# EAGLE design lednode (EAGLE 6.5.0)
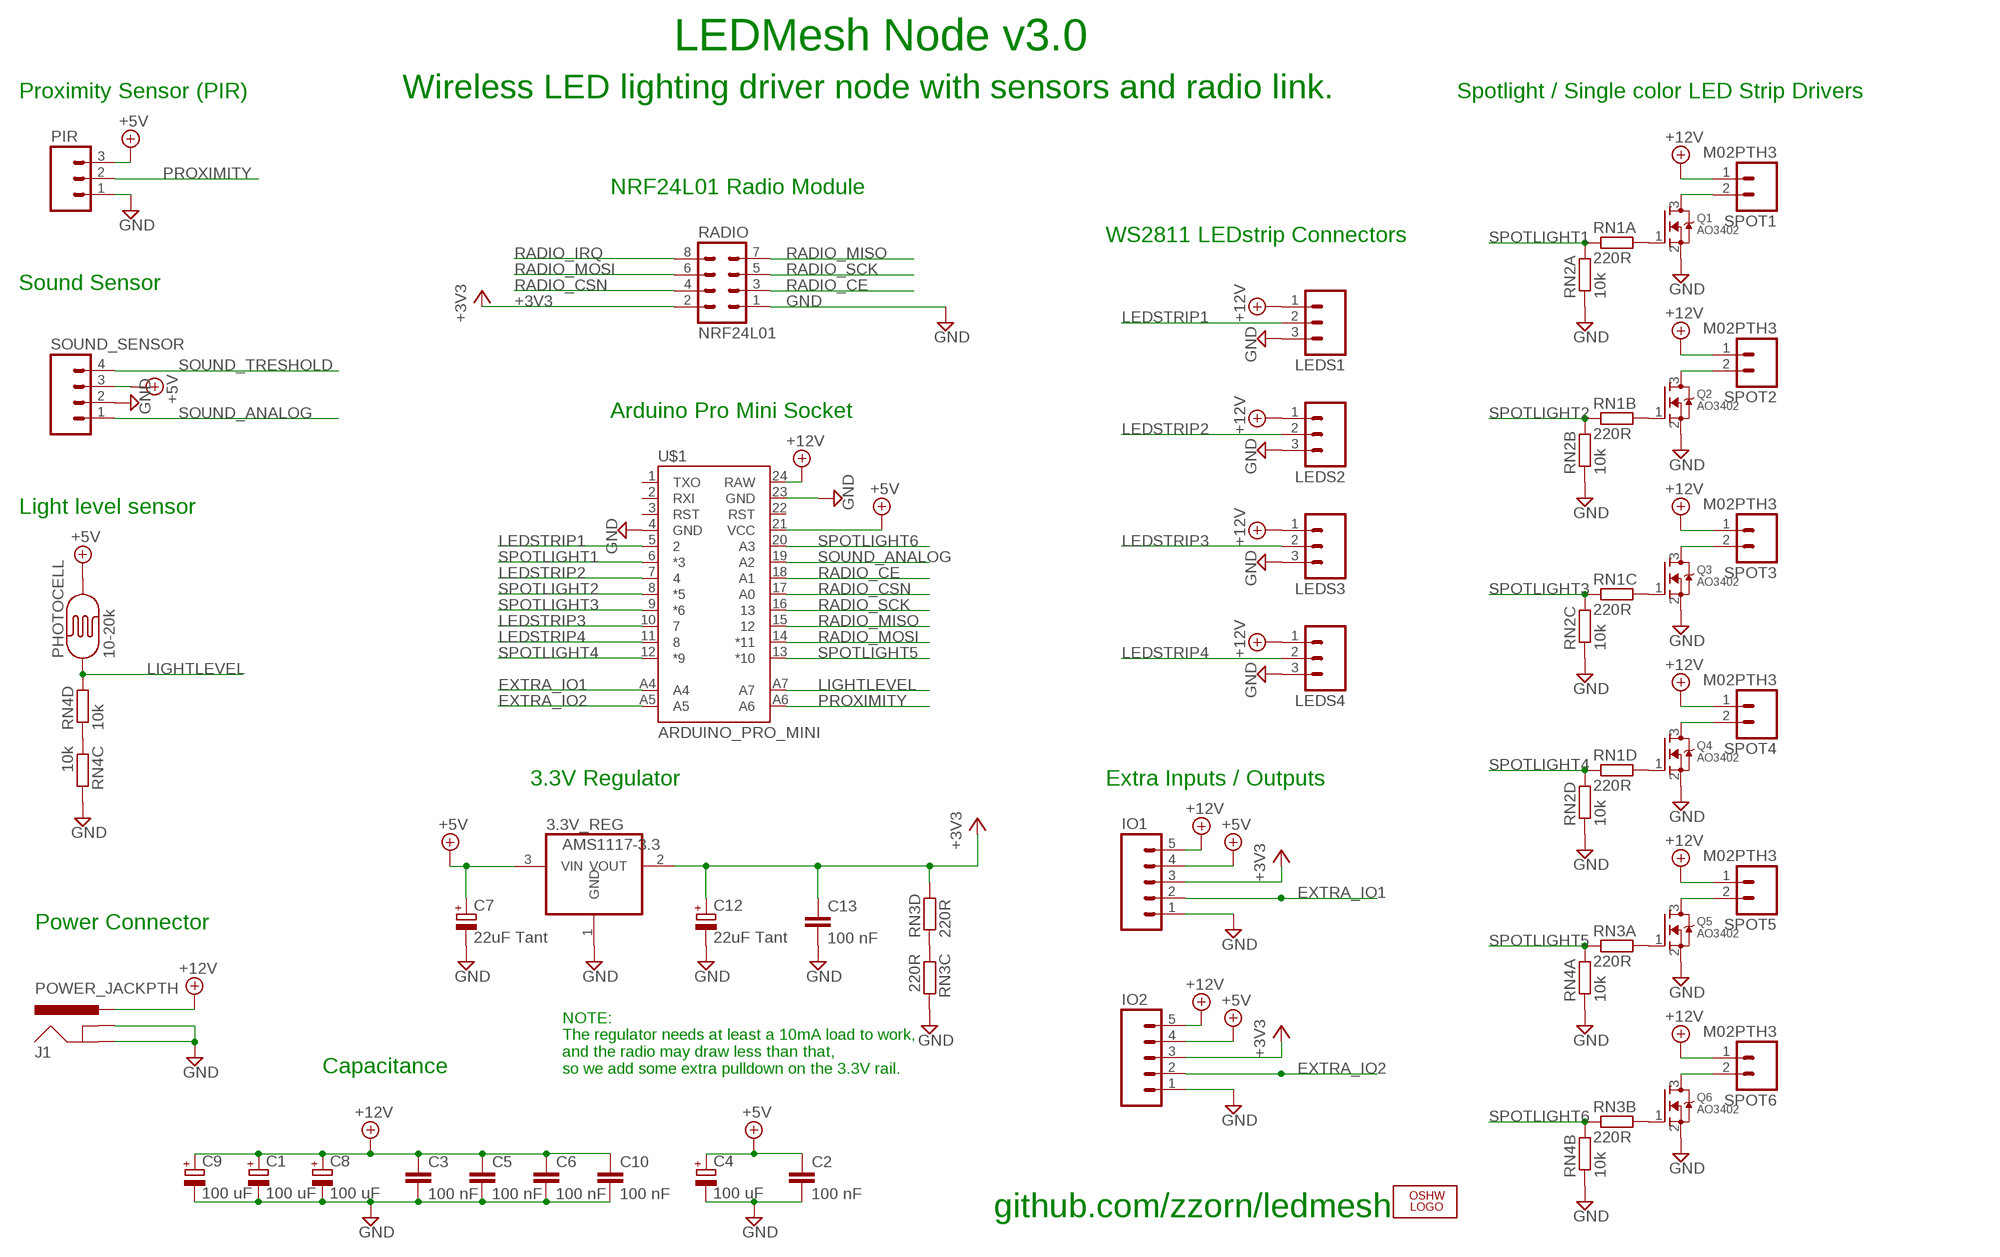
[diagram p0: schematic, sheet 1]

## Parts
3.3V_REG  AMS1117-3.3  REG1117  [SOT223]
C1  100 uF  CPOL-EUE2.5-6  [E2,5-6]
C2  100 nF  C-EUC0805  [C0805]
C3  100 nF  C-EUC0805  [C0805]
C4  100 uF  CPOL-EUE2.5-6  [E2,5-6]
C5  100 nF  C-EUC0805  [C0805]
C6  100 nF  C-EUC0805  [C0805]
C7  22uF Tant  CPOL-EUSMCA  [SMC_A]
C8  100 uF  CPOL-EUE2.5-6  [E2,5-6]
C9  100 uF  CPOL-EUE2.5-6  [E2,5-6]
C10  100 nF  C-EUC0805  [C0805]
C12  22uF Tant  CPOL-EUSMCA  [SMC_A]
C13  100 nF  C-EUC0805  [C0805]
IO1  M05PTH  [1X05]
IO2  M05PTH  [1X05]
J1  POWER_JACKPTH  [POWER_JACK_PTH]
LEDS1  M03LONGPADS  [1X03_LONGPADS]
LEDS2  M03LONGPADS  [1X03_LONGPADS]
LEDS3  M03LONGPADS  [1X03_LONGPADS]
LEDS4  M03LONGPADS  [1X03_LONGPADS]
LOGO3  LOGO-OSHW-8MILX0100-NT  [OSHW_8X100_NOTEXT]
PHOTOCELL  10-20k  PHOTOCELLPTH  [PHOTOCELL]
PIR  M03PTH  [1X03]
Q1  AO3402  MOSFET-NWAVE  [SOT23-W]
Q2  AO3402  MOSFET-NWAVE  [SOT23-W]
Q3  AO3402  MOSFET-NWAVE  [SOT23-W]
Q4  AO3402  MOSFET-NWAVE  [SOT23-W]
Q5  AO3402  MOSFET-NWAVE  [SOT23-W]
Q6  AO3402  MOSFET-NWAVE  [SOT23-W]
RADIO  NRF24L01  MA04-2  [MA04-2]
RN1  220R  RESISTOR_ARRAY_4  [RN8P-4R-CRA06S]
RN2  10k  RESISTOR_ARRAY_4  [RN8P-4R-CRA06S]
RN3  220R  RESISTOR_ARRAY_4  [RN8P-4R-CRA06S]
RN4  10k  RESISTOR_ARRAY_4  [RN8P-4R-CRA06S]
SOUND_SENSOR  M041X04_NO_SILK  [1X04_NO_SILK]
SPOT1  M02PTH3  [1X02_LONGPADS]
SPOT2  M02PTH3  [1X02_LONGPADS]
SPOT3  M02PTH3  [1X02_LONGPADS]
SPOT4  M02PTH3  [1X02_LONGPADS]
SPOT5  M02PTH3  [1X02_LONGPADS]
SPOT6  M02PTH3  [1X02_LONGPADS]
U$1  ARDUINO_PRO_MINI  [ARDUINO_PRO_MINI]

## Nets
+3V3: 3.3V_REG.2(VOUT) C12.+ C13.1 IO1.3 IO2.3 RADIO.2 RN3.5
+5V: 3.3V_REG.3(VIN) C2.1 C4.+ C7.+ IO1.4 IO2.4 PHOTOCELL.2 PIR.3 SOUND_SENSOR.3 U$1.21(VCC)
+12V: C1.+ C3.1 C5.1 C6.1 C8.+ C9.+ C10.1 IO1.5 IO2.5 J1.PWR LEDS1.1 LEDS2.1 LEDS3.1 LEDS4.1 SPOT1.1 SPOT2.1 SPOT3.1 SPOT4.1 SPOT5.1 SPOT6.1 U$1.24(RAW)
EXTRA_IO1: IO1.2 U$1.A4
EXTRA_IO2: IO2.2 U$1.A5
GND: 3.3V_REG.1(GND) C1.- C2.2 C3.2 C4.- C5.2 C6.2 C7.- C8.- C9.- C10.2 C12.- C13.2 IO1.1 IO2.1 J1.GND J1.GNDBREAK LEDS1.3 LEDS2.3 LEDS3.3 LEDS4.3 PIR.1 Q1.2(S) Q2.2(S) Q3.2(S) Q4.2(S) Q5.2(S) Q6.2(S) RADIO.1 RN2.1 RN2.2 RN2.3 RN2.4 RN3.6 RN4.1 RN4.2 RN4.6 SOUND_SENSOR.2 U$1.4(GND) U$1.23(GND)
LEDSTRIP1: LEDS1.2 U$1.5
LEDSTRIP2: LEDS2.2 U$1.7
LEDSTRIP3: LEDS3.2 U$1.10
LEDSTRIP4: LEDS4.2 U$1.11
LIGHTLEVEL: PHOTOCELL.1 RN4.5 U$1.A7
N$1: Q5.3(D) SPOT5.2
N$2: Q1.3(D) SPOT1.2
N$3: Q2.3(D) SPOT2.2
N$4: Q4.3(D) SPOT4.2
N$5: Q3.3(D) SPOT3.2
N$6: Q1.1(G) RN1.8
N$7: Q2.1(G) RN1.7
N$8: Q4.1(G) RN1.5
N$9: Q3.1(G) RN1.6
N$10: Q5.1(G) RN3.8
N$11: Q6.3(D) SPOT6.2
N$12: RN4.3 RN4.4
N$13: Q6.1(G) RN3.7
N$14: RN3.3 RN3.4
PROXIMITY: PIR.2 U$1.A6
RADIO_CE: RADIO.3 U$1.18(A1)
RADIO_CSN: RADIO.4 U$1.17(A0)
RADIO_IRQ: RADIO.8
RADIO_MISO: RADIO.7 U$1.15
RADIO_MOSI: RADIO.6 U$1.14(*11)
RADIO_SCK: RADIO.5 U$1.16
SOUND_ANALOG: SOUND_SENSOR.1 U$1.19(A2)
SOUND_TRESHOLD: SOUND_SENSOR.4
SPOTLIGHT1: RN1.1 RN2.8 U$1.6(*3)
SPOTLIGHT2: RN1.2 RN2.7 U$1.8(*5)
SPOTLIGHT3: RN1.3 RN2.6 U$1.9(*6)
SPOTLIGHT4: RN1.4 RN2.5 U$1.12(*9)
SPOTLIGHT5: RN3.1 RN4.8 U$1.13(*10)
SPOTLIGHT6: RN3.2 RN4.7 U$1.20(A3)
Unconnected: U$1.1(TXO) U$1.2(RXI) U$1.3(RST) U$1.22(RST)

## Notes on the sheet
- LEDMesh Node v3.0
- Proximity Sensor (PIR) | Wireless LED lighting driver node with sensors and radio link. | Spotlight / Single color LED Strip Drivers
- NRF24L01 Radio Module
- WS2811 LEDstrip Connectors
- Sound Sensor
- Arduino Pro Mini Socket
- Light level sensor
- 3.3V Regulator | Extra Inputs / Outputs
- Power Connector
- Capacitance
- NOTE:
  The regulator needs at least a 10mA load to work, 
  and the radio may draw less than that, 
  so we add some extra pulldown on the 3.3V rail.
- github.com/zzorn/ledmesh

## Library data of the parts
3.3V_REG = burr-brown:REG1117: 800mA and 1A Low Dropout (LDO) Positive Regulator 1.8V, 2.5V, 2.85V, 3.3V, 5V, and Adj; MPN: REG1117; OC_FARNELL: 1097566; OC_NEWARK: 14P6981
C1 C4 C7-C9 C12 = rcl:CPOL-EU: POLARIZED CAPACITOR, European symbol
C2 C3 C5 C6 C10 C13 = rcl:C-EU: CAPACITOR, European symbol
IO1 IO2 = SparkFun-Connectors:M05: Header 5 Standard 5-pin 0.1" header. Use with straight break away headers (SKU : PRT-00116), right angle break away headers (PRT-00553), swiss pins (PRT-00743), machine pins (PRT-00117), and female headers (PRT-00115). Molex polarized connector foot print use with SKU : PRT-08230 with associated crimp pins and housings.
J1 = SparkFun-Connectors:POWER_JACK: Power Jack This is the standard 5.5mm barrel jack for power. The PTH is the most common, proven, reliable, footprint. The Slot footprint only works if the mill layer is transmitted to the PCB fab house so be warned. Mating wall wart : TOL-00298 (and others); PROD_ID: PRT-00119
LEDS1-LEDS4 PIR = SparkFun-Connectors:M03: Header 3 Standard 3-pin 0.1" header. Use with straight break away headers (SKU : PRT-00116), right angle break away headers (PRT-00553), swiss pins (PRT-00743), machine pins (PRT-00117), and female headers (PRT-00115). Molex polarized connector foot print use with SKU : PRT-08232 with associated crimp pins and housings.
LOGO3 = Logo:LOGO-OSHW-8MIL
PHOTOCELL = SparkFun-Sensors:PHOTOCELL: CdS photoresistor. This is a low cost way to detect light levels. Resistance decreases with more incoming light. SparkFun SKU: SEN-09088
Q1-Q6 = adafruit:MOSFET-N: N-Channel Mosfet 2N7002E - 60V 260mA SOT23 [Digikey: 2N7002ET1GOSTR-ND] - REEL BSH103 - 30V 850mA SOT23 [Digikey: 568-5013-1-ND]
RADIO = con-lstb:MA04-2: PIN HEADER; OC_FARNELL: unknown; OC_NEWARK: unknown
RN1-RN4 = dp_devices:RESISTOR_ARRAY_4: 4 Resistor Array 0603
SOUND_SENSOR = SparkFun-Connectors:M04: Header 4 Standard 4-pin 0.1" header. Use with straight break away headers (SKU : PRT-00116), right angle break away headers (PRT-00553), swiss pins (PRT-00743), machine pins (PRT-00117), and female headers (PRT-00115). Molex polarized connector foot print use with SKU : PRT-08231 with associated crimp pins and housings. 1MM SMD Version SKU: PRT-10208
SPOT1-SPOT6 = SparkFun-Connectors:M02: Standard 2-pin 0.1" header. Use with - straight break away headers ( PRT-00116) - right angle break away headers (PRT-00553) - swiss pins (PRT-00743) - machine pins (PRT-00117) - female headers (PRT-00115) Molex polarized connector foot print use with: PRT-08233 with associated crimp pins and housings. 2.54_SCREWTERM for use with PRT-10571. 3.5mm Screw Terminal footprints for PRT-08084 5mm Screw Terminal footprints for use with PRT-08433
U$1 = SparkFun-Boards-with-arduino-pro-mini-without-connection-pins:ARDUINO_PRO_MINI

## Board
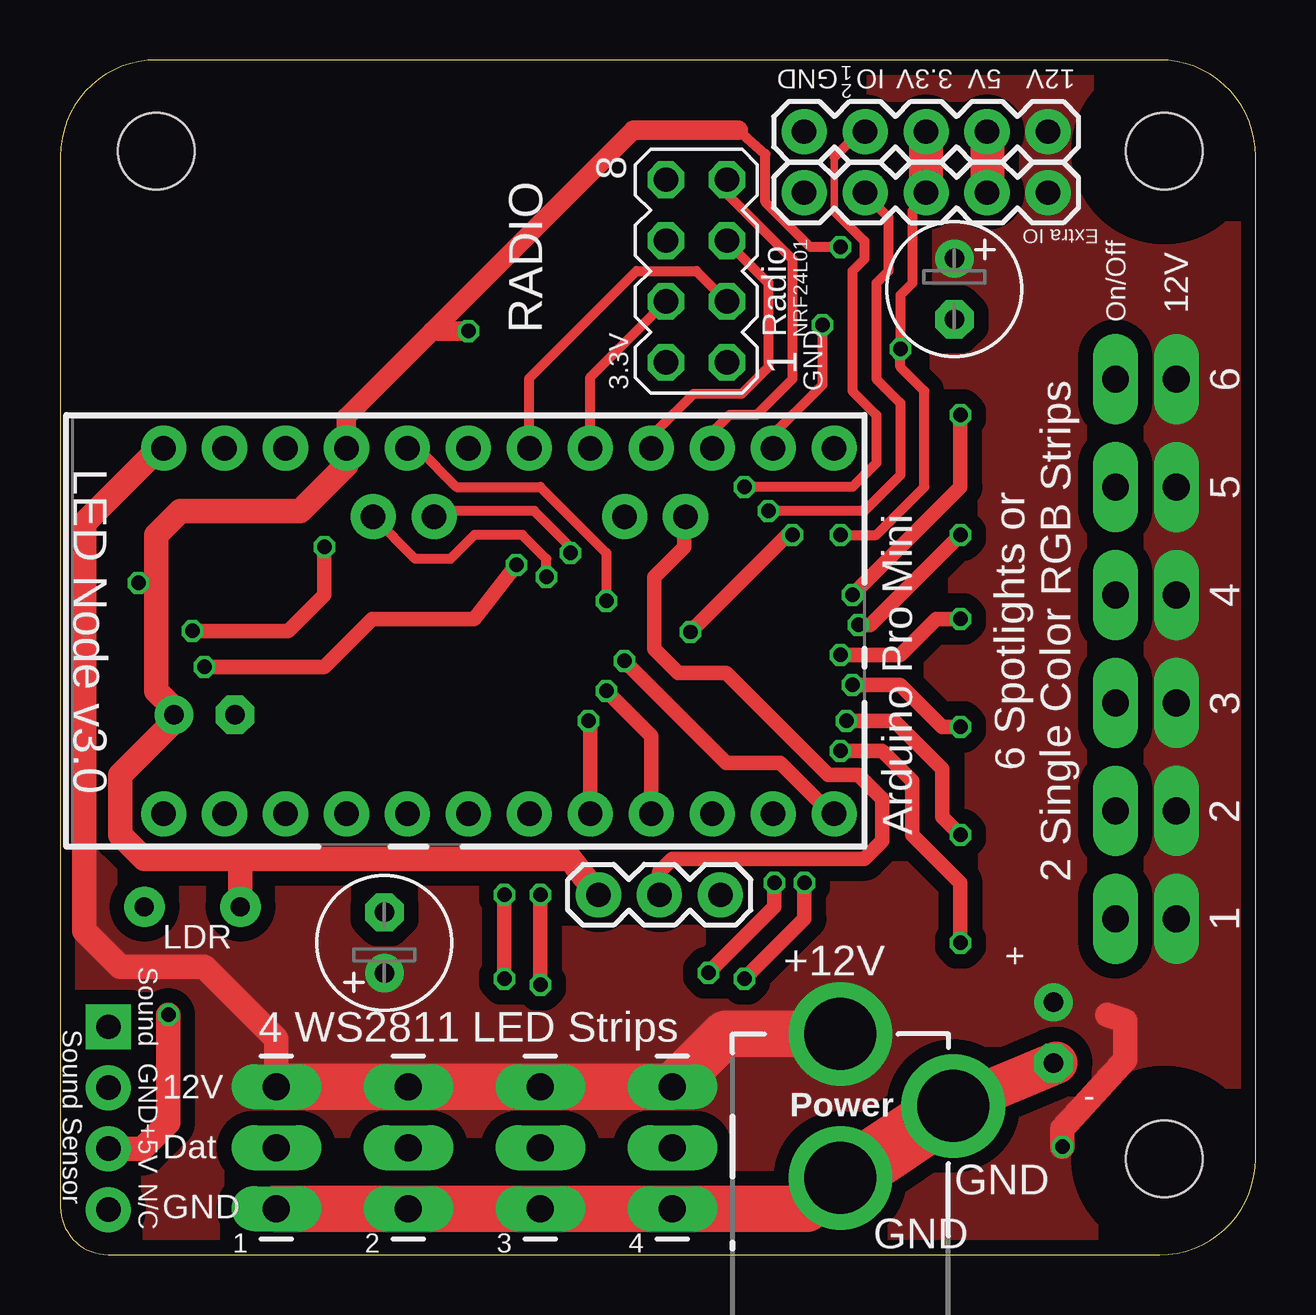
[diagram p1: board, top side]
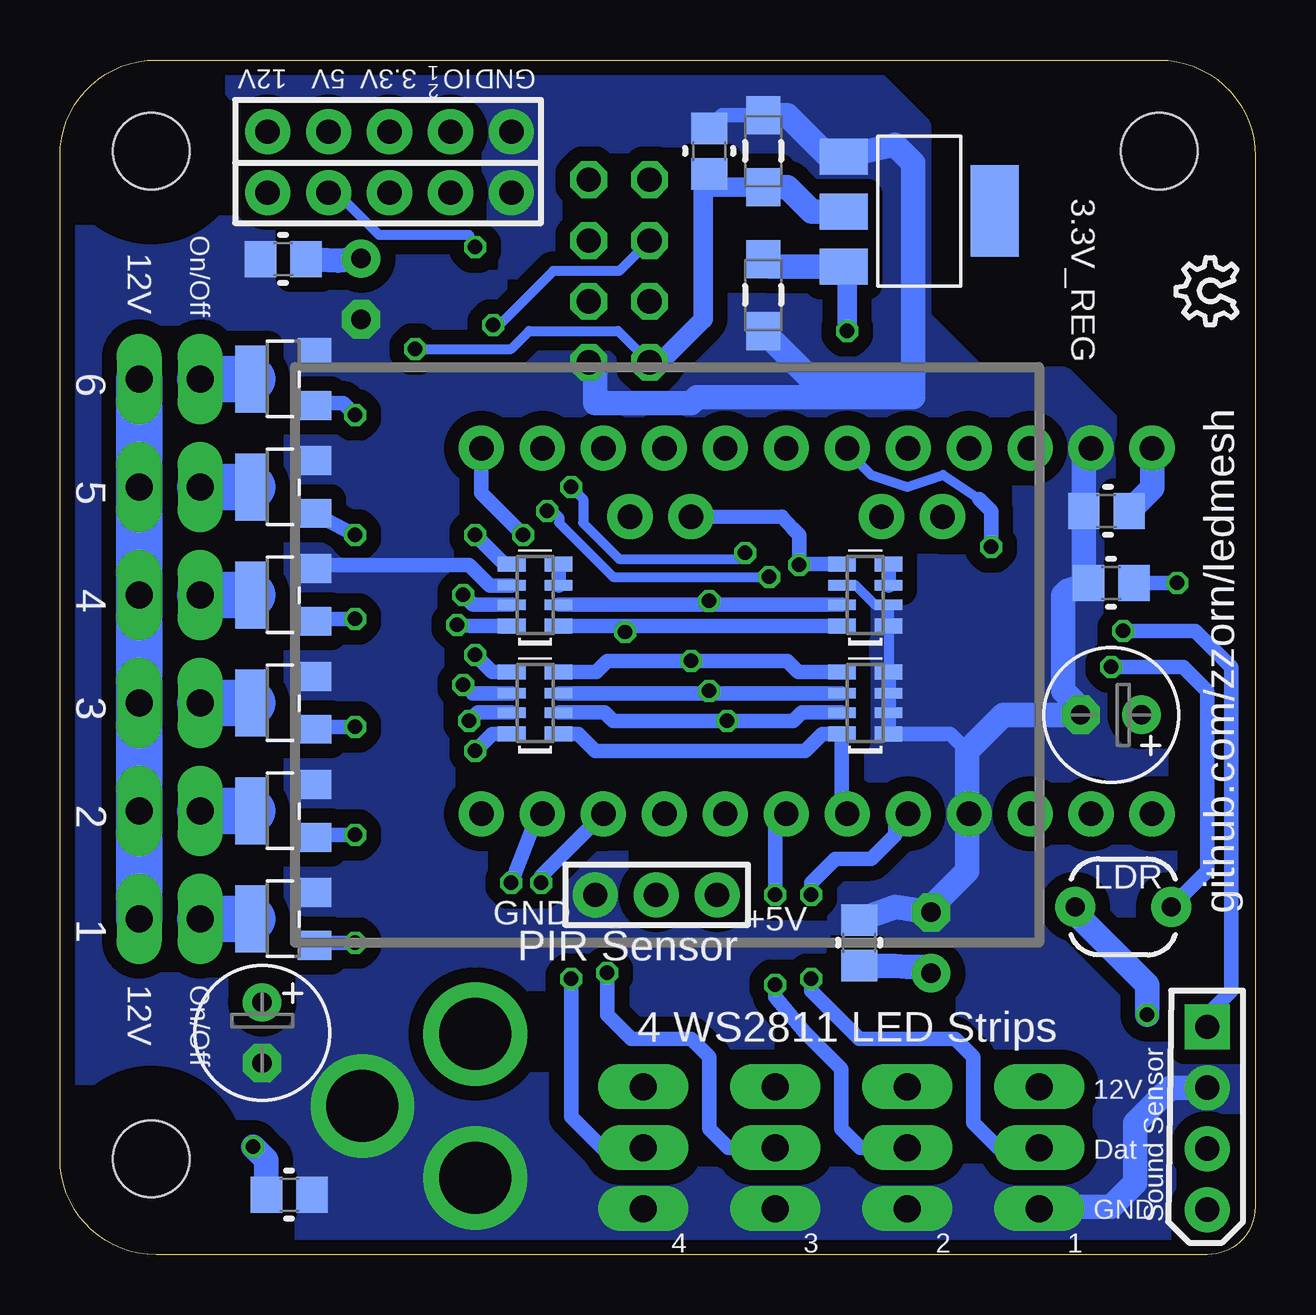
[diagram p2: board, bottom side, seen from below]

Size 49.8 x 49.8 mm. Coordinates in mm from the lower left corner, seen from the top.
Outline: 0,45.8 0,2 arc90 2,0 45.8,0 arc90 49.8,4 49.8,45.8 arc90 45.8,49.8 4,49.8 arc90 0,45.8
Copper layers (1*16): Top 0.035mm / dielectric 1.5mm / Bottom 0.035mm
Design rules "SeeedStudio_2layer_DRU_no_angle_20140221": minimum track width 6mil, minimum drill 12mil, track to track 6mil, track to pad 6mil, pad to pad 6mil, via to via 6mil, smd to smd 0mil, copper to edge 10mil, drill to drill 10mil, minimum pad ring 10mil, minimum via ring 6mil, stop-mask expansion 2mil, vias tented up to drill 100mil, thermal gap 10mil
Holes 3.2 mm at 46,46 46,4 4,46
tRestrict: area 44,2 to 48,6; area 44,44 to 48,48; area 2,44 to 6,48
bRestrict: area 44,2 to 48,6; area 44,44 to 48,48; area 2,44 to 6,48

### Footprints (pad centres in the part's own frame; a part is rotated, then mirrored left to right if it is on the bottom)
SOT223 = smd 1.499 x 2.007: 1 -2.261,-3.15; 2 0.025,-3.15; 3 2.311,-3.15 | smd 3.81 x 2.007: 4 0,3.15
E2,5-6 = drill 0.813 pad 1.6: + -1.27,0 | drill 0.813 pad 1.6 octagon: - 1.27,0
C0805 = smd 1.3 x 1.5: 1 -0.95,0; 2 0.95,0
SMC_A = smd 1.6 x 1.4: + -1.5,0; - 1.5,0
1X05 = drill 1.016 pad 1.88: 1 0,0; 2 2.54,0; 3 5.08,0; 4 7.62,0; 5 10.16,0
POWER_JACK_PTH = drill 2.997 pad 4.318: GND 0,7.7; GNDBREAK 4.7,10.7; PWR 0,13.7
1X03_LONGPADS = drill 1.118 pad 1.88 long: 1 0,0; 2 2.54,0; 3 5.08,0
PHOTOCELL = drill 0.8 pad 1.676: 1 -2,0; 2 2,0
1X03 = drill 1.016 pad 1.88: 1 0,0; 2 2.54,0; 3 5.08,0
SOT23-W = smd 1.2 x 1.4: 1 -1.1,-1.3; 2 1.1,-1.3 | smd 2.8 x 1.4: 3 0,1.3
MA04-2 = drill 1.016 octagon: 1 -3.81,-1.27; 2 -3.81,1.27; 3 -1.27,-1.27; 4 -1.27,1.27; 5 1.27,-1.27; 6 1.27,1.27; 7 3.81,-1.27; 8 3.81,1.27
RN8P-4R-CRA06S = smd 0.63 x 1.15: 1 -1.295,-0.975; 4 1.295,-0.975; 5 1.295,0.975; 8 -1.295,0.975 | smd 0.44 x 1.15: 2 -0.4,-0.975; 3 0.4,-0.975; 6 0.4,0.975; 7 -0.4,0.975
1X04_NO_SILK = drill 1.016 pad 1.88 square: 1 0,0 | drill 1.016 pad 1.88: 2 2.54,0; 3 5.08,0; 4 7.62,0
1X02_LONGPADS = drill 1.118 pad 1.88 long: 1 0,0; 2 2.54,0
ARDUINO_PRO_MINI = drill 1.016 pad 1.88: 1 -7.62,12.7; 2 -7.62,10.16; 3 -7.62,7.62; 4 -7.62,5.08; 5 -7.62,2.54; 6 -7.62,0; 7 -7.62,-2.54; 8 -7.62,-5.08; 9 -7.62,-7.62; 10 -7.62,-10.16; 11 -7.62,-12.7; 12 -7.62,-15.24; 13 7.62,-15.24; 14 7.62,-12.7; 15 7.62,-10.16; 16 7.62,-7.62; 17 7.62,-5.08; 18 7.62,-2.54; 19 7.62,0; 20 7.62,2.54; 21 7.62,5.08; 22 7.62,7.62; 23 7.62,10.16; 24 7.62,12.7; A4 4.763,1.429; A5 4.763,3.969; A6 4.763,-9.049; A7 4.763,-6.509

### Placement (x,y rotation side)
3.3V_REG  14,43.5 270 bottom
C1  13.5,13 90 top
C2  6,28 180 bottom
C3  16.5,13 90 bottom
C4  6,22.5 180 bottom
C5  6.2,31 180 bottom
C6  40.5,41.5 180 bottom
C7  20.5,40 270 bottom
C8  41.38,9.25 270 bottom
C9  37.25,40.25 270 top
C10  40.25,2.5 0 bottom
C12  20.5,46 90 bottom
C13  22.75,46 90 bottom
IO1  30.99,46.81 0 top
IO2  30.99,44.27 0 top
J1  32.5,-4.5 0 top
LEDS1  9,7 270 top
LEDS2  14.5,7 270 top
LEDS3  20,7 270 top
LEDS4  25.5,7 270 top
LOGO3  0.75,38.75 90 bottom
PHOTOCELL  5.5,14.5 180 bottom
PIR  27.5,15 180 top
Q1  40.5,14 90 bottom
Q2  40.5,18.5 90 bottom
Q3  40.5,23 90 bottom
Q4  40.5,27.5 90 bottom
Q5  40.5,32 90 bottom
Q6  40.5,36.5 90 bottom
RADIO  26.5,41 90 top
RN1  30,23 90 bottom
RN2  16.25,23 90 bottom
RN3  30,27.5 90 bottom
RN4  16.25,27.5 90 bottom
SOUND_SENSOR  2,9.5 270 top
SPOT1  46.5,14 180 top
SPOT2  46.5,18.5 180 top
SPOT3  46.5,23 180 top
SPOT4  46.5,27.5 180 top
SPOT5  46.5,32 180 top
SPOT6  46.5,36.5 180 top
U$1  17,26 90 top

### Tracks (layer width: path | path; a pad name or v marks a point on that pad's centre or on a via)
+3V3  (via drill 0.6)
  Top 0.406: IO2.3 35.82,43.82 35.5,43.5 35.5,40.5 35,40 v35,37.75 35,37 36,36 36,32 34,30 v32.5,30
  Top 1.422: IO2.3 IO1.3
  Bottom 0.406: 24.81,37.19 RADIO.2 26.54,38.5 30.25,38.5 31,37.75 v35,37.75
  Bottom 0.61: RN3.5 31.3,28.8 v32.5,30 | C13.1 22.7,44.5
  Bottom 0.813: 24.81,37.19 23,39 23,44.5 22.7,44.5 C12.+
  Bottom 1.016: 3.3V_REG.2 18.48,43.48 19.5,44.5 C12.+
+5V  (via drill 0.6)
  Top 0.406: v32.5,42 31.25,42 29.38,43.88 29.38,45.88 28.25,46.88
  Top 0.61: v3.25,28 4,28
  Top 0.813: U$1.21 11.92,34.92 15.5,38.5 | 15.5,38.5 v17,38.5 | 28.25,46.88 23.88,46.88 15.5,38.5
  Top 1.016: U$1.21 11.92,32.92 10,31 5,31 4,30 4,28 4,23.5 4.5,23 C4.+ 4.77,22.27 2.5,20 2.5,17.5 3.5,16.5 7.5,16.5 | PIR.3 21.25,16.5 7.5,16.5 | SOUND_SENSOR.3 3.42,4.42 4.5,5.5 v4.5,10 | PHOTOCELL.2 7.5,16.5
  Top 1.422: IO1.4 IO2.4
  Bottom 0.406: v32.5,42 32.75,42.5 36.5,42.5 38,44 38.34,44 IO2.4
  Bottom 0.61: C2.1 v3.25,28
  Bottom 0.813: v17,38.5 17,41.04 3.3V_REG.3
  Bottom 1.016: 3.3V_REG.3 20.19,41.19 C7.+ | v4.5,10 4.5,11.25 7.5,14.25 PHOTOCELL.2
+12V  (via drill 0.6)
  Top 1.016: U$1.24 4.12,33.62 1,30.5 1,13.5 2.5,12 6,12 9,9 LEDS1.1 | v41.75,4.5 41.75,5.25 44.38,8.12 44.38,9.75 43.62,10
  Top 1.93: LEDS1.1 LEDS2.1 LEDS3.1 LEDS4.1 27.7,9.2 J1.PWR
  Bottom 1.016: C3.1 15.05,12.05 14.5,12 13.77,12 C1.+ | U$1.24 4.3,31.95 C5.1 | C10.1 41.2,3.95 v41.75,4.5 | C6.1 38.2,41.43 C9.+
  Bottom 1.93: SPOT6.1 SPOT5.1 SPOT4.1 SPOT3.1 SPOT2.1 SPOT1.1
  pour Top (isolate 0.61, no thermals): 0,17 34,17 34,50 50,50 50,0 0,0
EXTRA_IO1  (via drill 0.6)
  Top 0.305: 32.25,45.75 32.25,43.5
  Top 0.406: IO1.2 33.28,46.78 32.25,45.75 | 32.25,43.5 33.5,42.25 33.5,41.5 33,41 33,36 34,35 34,33 33,32 v28.5,32 | v21.25,29.25 21.25,29.5 19.75,31 16.06,31 U$1.A4
  Bottom 0.406: v28.5,32 28,31.5 28,30.5 26.5,29 21.5,29 v21.25,29.25
EXTRA_IO2  (via drill 0.6)
  Top 0.406: IO2.2 33.53,44.22 34.5,43.25 34.5,41 34,40.5 34,36.5 35,35.5 35,32.5 33.5,31 v29.5,31 | v20.25,28.25 20.25,29 19.25,30 17.25,30 16.25,29 14.79,29 U$1.A5
  Bottom 0.406: v29.5,31 29.25,31 29,30.75 29,30.5 26.75,28.25 v20.25,28.25
GND
  Top 1.778: J1.GNDBREAK 41.5,8
  Top 1.93: LEDS1.3 LEDS2.3 LEDS3.3 LEDS4.3 31.09,1.92 J1.GND 32.7,3.2
  Top 2.54: 32.7,3.2 37.25,6.25
  Bottom 0.406: RN4.6 16.65,27.9 15.85,27.1 RN4.2 RN4.1 RN2.4
  Bottom 0.61: RN2.4 RN2.3 RN2.2 RN2.1 12.71,21.7 12,21 | RN3.6 31.9,27.9 32.75,28.75 39.05,28.75 Q4.2 | C13.2 22.2,47.5 C12.-
  Bottom 1.016: C12.- 19.5,47.5 17.76,45.76 3.3V_REG.1 15.01,46.26 14.25,45.5 14.25,35.75 23.25,35.75 23.5,35.5 27.5,35.5 27.5,36.75 27.75,37 | 14.25,36.75 14.5,36.5 18.5,36.5 C7.- | U$1.23 7.15,33.31 C5.2 7.15,28.2 C2.2 7.77,27.68 7.82,27.68 8,27.5 8,23.5 7.5,23 C4.- 10.5,22.5 12,21 12,18.46 U$1.4 12,18.3 12,16 13.5,14.5 C1.- 15,14.5 C3.2 | SOUND_SENSOR.2 3.54,6.96 5,5.5 5,3 6,2 8.92,2 LEDS1.3
  pour Bottom (isolate 0.61, no thermals): 5,33.5 8,36.5 11.5,36.5 14,39 14,47 17,50 50,50 50,0 0,0 0,17 4,19
LEDSTRIP1  (via drill 0.6)
  Top 0.61: v18.5,11.5 v18.5,15
  Bottom 0.61: LEDS1.2 10.71,4.46 11.75,5.5 11.75,8.25 12.5,9 16.5,9 18.5,11 v18.5,11.5 | v18.5,15 18.5,15.5 17.5,16.5 16,16.5 15,17.5 15,17.84 U$1.5
LEDSTRIP2  (via drill 0.6)
  Top 0.61: v20,11.25 v20,15
  Bottom 0.61: LEDS2.2 16.46,4.46 17.25,5.25 17.25,7.75 18.75,9.25 20,10.75 v20,11.25 | v20,15 20,18 U$1.7
LEDSTRIP3  (via drill 0.6)
  Top 0.61: v27,11.75 29.75,14.5 v29.75,15.5
  Bottom 0.61: LEDS3.2 21.96,4.46 22.75,5.25 22.75,8.25 23.5,9 26,9 27,10 v27,11.75 | v29.75,15.5 29.75,15.79 U$1.10
LEDSTRIP4  (via drill 0.6)
  Top 0.61: v28.5,11.5 31,14 v31,15.5
  Bottom 0.61: LEDS4.2 27.21,4.46 28.5,5.75 v28.5,11.5 | v31,15.5 30,18.08 U$1.11
LIGHTLEVEL  (via drill 0.6)
  Top 0.61: v6,24.5 11,24.5 13,26.5 17.25,26.5 v19,28.75
  Bottom 0.61: PHOTOCELL.1 2,16 2,23.5 3,24.5 v6,24.5 | v19,28.75 19,29 | RN4.5 18.95,28.8 19,29 | U$1.A7 19.75,30.75 19.74,30.76 19.26,30.26 19,30 19,29
N$1
  Bottom 1.93: Q5.3 SPOT5.2
N$2
  Bottom 1.93: Q1.3 SPOT1.2
N$3
  Bottom 1.93: Q2.3 SPOT2.2
N$4
  Bottom 1.93: Q4.3 SPOT4.2
N$5
  Bottom 1.93: Q3.3 SPOT3.2
N$6  (via drill 0.6)
  Top 0.61: v32.5,21 34.25,21 35.5,19.75 35.5,17.5 37.5,15.5 v37.5,13
  Bottom 0.61: RN1.8 31.8,21.7 v32.5,21 | v37.5,13 39.1,13 Q1.1
N$7  (via drill 0.6)
  Top 0.61: v32.75,22.25 34.75,22.25 36.75,20.25 36.75,18.25 v37.5,17.5
  Bottom 0.61: RN1.7 32.4,22.6 v32.75,22.25 | v37.5,17.5 39.1,17.5 Q2.1
N$8  (via drill 0.6)
  Top 0.61: v32.5,25 35,25 36.5,26.5 v37.5,26.5
  Bottom 0.61: RN1.5 31.8,24.3 v32.5,25 | v37.5,26.5 39.1,26.5 Q4.1
N$9  (via drill 0.6)
  Top 0.61: v33,23.75 35,23.75 36.75,22 v37.5,22
  Bottom 0.61: RN1.6 32.6,23.4 v33,23.75 | v37.5,22 39.1,22 Q3.1
N$10  (via drill 0.6)
  Top 0.61: v33.25,26.25 33.75,26.25 v37.5,30
  Bottom 0.61: RN3.8 32.7,26.2 v33.25,26.25 | v37.5,30 Q5.1
N$11
  Bottom 1.93: Q6.3 SPOT6.2
N$12
  Bottom 0.61: RN4.3 RN4.4
N$13  (via drill 0.6)
  Top 0.61: v33,27.5 37.5,32 v37.5,35
  Bottom 0.61: RN3.7 32.6,27.1 v33,27.5 | v37.5,35 38,35.5 39.1,35.5 Q6.1
N$14
  Bottom 0.61: RN3.4 RN3.3
PROXIMITY
  Top 0.61: PIR.2 24.96,15.96 25.5,16.5 33.5,16.5 34.25,17.25 34.25,19 33.25,20 32,20 27.75,24.25 25.75,24.25 24.75,25.25 24.75,28.25 26,29.5 26,30.71 U$1.A6
RADIO_CE
  Top 0.406: U$1.18 19.54,36.54 24,41 26.5,41 RADIO.3
RADIO_CSN
  Top 0.406: U$1.17 22.08,36.58 RADIO.4
RADIO_MISO
  Top 0.406: RADIO.7 27.77,44.23 30.5,41.5 30.5,36.5 29,35 27.88,35 27.16,34.28 U$1.15
RADIO_MOSI  (via drill 0.6)
  Top 0.406: v31.75,38.75 31.75,36.25 29.7,34.2 U$1.14
  Bottom 0.406: RADIO.6 26.5,41 29.25,41 31.5,38.75 v31.75,38.75
RADIO_SCK
  Top 0.406: RADIO.5 27.77,42.23 29.5,40.5 29.5,37 28.38,35.88 26.38,35.88 24.62,34.12 U$1.16
SOUND_ANALOG  (via drill 0.6)
  Top 0.61: v5.5,26 9.5,26 11,27.5 v11,29.5
  Bottom 0.406: U$1.19 17,33.5 16,32.5 14.5,32 13,32.5 11.5,31.5
  Bottom 0.61: SOUND_SENSOR.1 2,10 1,11 1,24.5 2.5,26 v5.5,26 | v11,29.5 11,31 11.5,31.5
SPOTLIGHT1
  Bottom 0.61: RN1.1 28.2,21.7 27.5,21 18.75,21 18.05,21.7 RN2.8 17.23,18.61 U$1.6
SPOTLIGHT2  (via drill 0.6)
  Top 0.61: U$1.8 22.08,21.92 v22,22.25
  Bottom 0.61: RN2.7 18.9,22.6 19.25,22.25 v22,22.25 26.75,22.25 27.1,22.6 RN1.2
SPOTLIGHT3  (via drill 0.6)
  Top 0.61: U$1.9 24.62,21.63 v22.75,23.5
  Bottom 0.61: RN2.6 22.75,23.4 | 22.75,23.4 RN1.3 | v22.75,23.5 22.75,23.4
SPOTLIGHT4  (via drill 0.6)
  Top 0.61: U$1.12 32.12,18.38 30,20.5 27.75,20.5 v23.5,24.75
  Bottom 0.61: RN2.5 19.05,24.3 19.5,24.75 v23.5,24.75 27,24.75 27.45,24.3 RN1.4
SPOTLIGHT5  (via drill 0.6)
  Top 0.61: v30.5,30 30.25,29.95 v26.25,25.95
  Bottom 0.61: RN4.8 26.25,26.2 | U$1.13 32.24,31.74 v30.5,30 | RN3.1 26.25,26.2 | 26.25,26.2 v26.25,25.95
SPOTLIGHT6  (via drill 0.6)
  Top 0.406: U$1.20 14.88,33.62 16.5,32 20,32 22.75,29.25 v22.75,27.25
  Bottom 0.406: v22.75,27.25 22.75,27.1
  Bottom 0.61: RN4.7 22.75,27.1 RN3.2

### Text on the board
tPlace: + | -
tSilk: GND | 1 | IO | 3.3V | 5V | 12V | 2 | On/Off | 12V | 3.3V | GND | 6 | 4 | 6 Spotlights or / 2 Single Color RGB Strips | Arduino Pro Mini | 2 | 1 | LDR | Sound | +12V | 4 WS2811 LED Strips | GND | Sound Sensor | +5V | 12V | Power | Dat | N/C | GND | GND | 1 | 2 | 3 | 4 | GND
_tsilk: Extra IO | Radio | NRF24L01 | 5 | LED Node v3.0 | 3
_bsilk: GND | IO | 1 | 3.3V | 5V | 12V | 2 | On/Off | 12V | 6 | 5 | 4 | github.com/zzorn/ledmesh | 3 | 2 | LDR | +5V | GND | 1 | PIR Sensor | On/Off | 12V | 4 WS2811 LED Strips | 12V | Sound Sensor | Dat | GND | 1 | 2 | 3 | 4